# Altium schematic sheet Final_Project_Schematic.SchDoc
size A; SheetNumber: 1; SheetTotal: 1; SPICEModelCacheSEEFEDUI: <root> / <DocumentId>SEEFEDUI</DocumentId> / <CacheFrame Number="0"> / <Model Name="cap" Kind="MDL"> / <Text>*Default semiconductor capacitor / .MODEL CAP C()</Text> / </Model> / <Model Name="led2" Kind="MDL"> / <Text>*Typ RED,GREEN,YELLOW,AMBER GaAs LED: Vf=2.1V Vr=4V If=40mA trr=3uS / *LED Pinout: 1=A, 2=K / .MODEL LED2 D (IS=93.1P RS=42M N=4.61 BV=4 IBV=10U / + CJO=2.97P VJ=.75 M=.333 TT=4.32U)</Text> / </Model> / </CacheFrame> / </root>
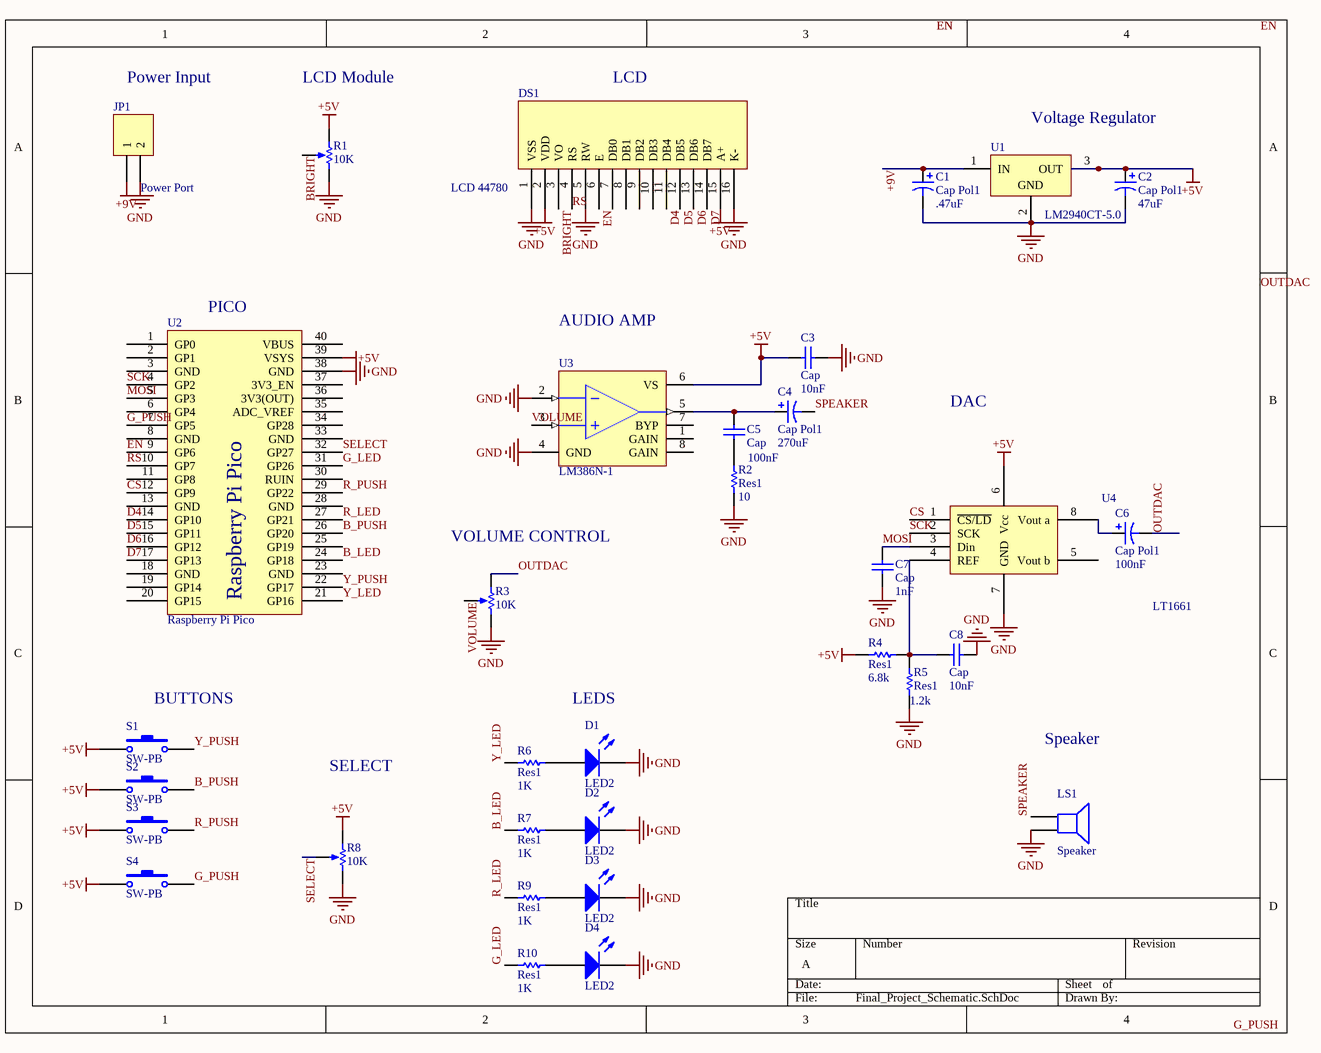
[diagram p0: Final_Project_Schematic.SchDoc]

## Parts
C1  Cap Pol1  value .47uF  [RB7.6-15]
C2  Cap Pol1  value 47uF  [RB7.6-15]
C3  Cap  value 10nF  [RAD-0.3]
C4  Cap Pol1  value 270uF  [RB7.6-15]
C5  Cap  value 100nF  [RAD-0.3]
C6  Cap Pol1  value 100nF  [RB7.6-15]
C7  Cap  value 1nF  [RAD-0.3]
C8  Cap  value 10nF  [RAD-0.3]
D1  LED2  [3.2X1.6X1.1]
D2  LED2  [3.2X1.6X1.1]
D3  LED2  [3.2X1.6X1.1]
D4  LED2  [3.2X1.6X1.1]
DS1  LCD 44780  [OLED 16x2]
JP1  Power Port  [CON2screw]
LS1  Speaker  [PIN2]
R1  value 10K  [POT OFFSET 200]  (hidden comment: RPot_3)
R2  Res1  value 10  [AXIAL-0.3]
R3  value 10K  [POT OFFSET 200]  (hidden comment: RPot_3)
R4  Res1  value 6.8k  [AXIAL-0.3]
R5  Res1  value 1.2k  [AXIAL-0.3]
R6  Res1  value 1K  [AXIAL-0.3]
R7  Res1  value 1K  [AXIAL-0.3]
R8  value 10K  [POT OFFSET 200]  (hidden comment: RPot_3)
R9  Res1  value 1K  [AXIAL-0.3]
R10  Res1  value 1K  [AXIAL-0.3]
S1  SW-PB  [SW PB vertical]
S2  SW-PB  [SW PB vertical]
S3  SW-PB  [SW PB vertical]
S4  SW-PB  [SW PB vertical]
U1  LM2940CT-5.0  [T03B]
U2  Raspberry Pi Pico  [Raspberry Pi Pico]
U3  LM386N-1  [DIP-8]
U4  LT1661  [DIP-8]

## Nets
+5V: C2.1 C3.1 DS1.2(VDD) DS1.15(A+) R1.1(TOP) R4.1 R8.1(TOP) S1.1 S2.1 S3.1 S4.1 U1.3(OUT) U2.39(VSYS) U3.6(VS) U4.6(Vcc)
+9V: C1.1 JP1.1 U1.1(IN)
GND: C1.2 C2.2 C3.2 C7.1 C8.2 D1.2(K) D2.2(K) D3.2(K) D4.2(K) DS1.1(VSS) DS1.5(RW) DS1.16(K-) JP1.2 LS1.2 R1.3(BOT) R2.1 R3.3(BOT) R5.1 R8.3(BOT) U1.2(GND) U2.38(GND) U3.2(IN-) U3.4(GND) U4.7(GND)
B_LED: R7.1 U2.24(GP18)
B_PUSH: S2.2 U2.26(GP20)
BRIGHT: DS1.3(VO) R1.2(TAP)
CS: U2.12(GP9) U4.1(~{CS/LD})
D4: DS1.11(DB4) U2.14(GP10)
D5: DS1.12(DB5) U2.15(GP11)
D6: DS1.13(DB6) U2.16(GP12)
D7: DS1.14(DB7) U2.17(GP13)
EN: DS1.6(E) U2.9(GP6)
G_LED: R10.1 U2.31(GP26)
G_PUSH: S4.2 U2.7(GP5)
MOSI: C7.2 U2.5(GP3) U4.3(Din)
OUTDAC: C6.2 R3.1(TOP)
R_LED: R9.1 U2.27(GP21)
R_PUSH: S3.2 U2.29(GP22)
RS: DS1.4(RS) U2.10(GP7)
SCK: U2.4(GP2) U4.2(SCK)
SELECT: R8.2(TAP) U2.32(GP27)
SPEAKER: C4.2 LS1.1
VOLUME: R3.2(TAP) U3.3(IN+)
Y_LED: R6.1 U2.21(GP16)
Y_PUSH: S1.2 U2.22(GP17)
NetC4_1: C4.1 C5.2 U3.5(OUT)
NetC5_1: C5.1 R2.2
NetC6_1: C6.1 U4.8(Vout_a)
NetC8_1: C8.1 R4.2 R5.2 U4.4(REF)
NetD1_1: D1.1(A) R6.2
NetD2_1: D2.1(A) R7.2
NetD3_1: D3.1(A) R9.2
NetD4_1: D4.1(A) R10.2

Not connected (* = marked no-connect by the designer): DS1 7(DB0) 8(DB1) 9(DB2) 10(DB3); U2 1(GP0) 2(GP1) 3(GND) 6(GP4) 8(GND) 11(GP8) 13(GND) 18(GND) 19(GP14) 20(GP15) 23(GND) 25(GP19) 28(GND) 30(RUIN) 33(GND) 34(GP28) 35(ADC_VREF) 36(3V3(OUT)) 37(3V3_EN) 40(VBUS); U3 1(GAIN) 7(BYP) 8(GAIN); U4 5(Vout_b)

## Notes on the sheet
- Power Input
- LCD Module
- LCD
- Voltage Regulator
- (near U2) PICO
- AUDIO AMP
- DAC
- (near R3) VOLUME CONTROL
- (near S1) BUTTONS
- LEDS
- SELECT
- Speaker
- Labels drawn without touching a wire or pin: EN, G_PUSH, OUTDAC

## Library data of the parts
C1 C2 C4 C6 = Cap Pol1: Polarized Capacitor (Radial); Published: 8-Jun-2000; LatestRevisionDate: 17-Jul-2002; LatestRevisionNote: Re-released for DXP Platform.; PackageReference: RB7.6-15; Publisher: Altium Limited; PackageDescription: Polarized Capacitor (Radial); 2 Leads
C3 C5 C7 C8 = Cap: Capacitor; Published: 8-Jun-2000; LatestRevisionDate: 17-Jul-2002; LatestRevisionNote: Re-released for DXP Platform.; PackageReference: RAD-0.3; Publisher: Altium Limited; PackageDescription: Radial Cap, Thru-Hole; 2 Leads; 0.3 in Pin Spacing
D1-D4 = LED2: Typical RED, GREEN, YELLOW, AMBER GaAs LED; Published: 8-Jun-2000; LatestRevisionDate: 17-Jul-2002; LatestRevisionNote: Re-released for DXP Platform.; PackageVersion: Feb-2002; PackageReference: 3.2X1.6X1.1; Publisher: Altium Limited; PackageDescription: SM LED; 2 Flat Leads
JP1 = Power
LS1 = Speaker: Loudspeaker; Published: 24-Mar-1999; LatestRevisionDate: 17-Jul-2002; LatestRevisionNote: Re-released for DXP Platform.; PackageReference: PIN2; Publisher: Altium Limited
R1 R3 R8 = RPot: Potentiometer; Sim Note: Enter the Resistance value and the set point into parameter fields.; Set Position: 0.5; Published: 8-Jun-2000; LatestRevisionDate: 17-Jul-2002; LatestRevisionNote: Re-released for DXP Platform.; Publisher: Altium Limited
R2 R4-R7 R9 R10 = Res1: Resistor; Published: 8-Jun-2000; LatestRevisionDate: 17-Jul-2002; LatestRevisionNote: Re-released for DXP Platform.; PackageReference: AXIAL-0.3; Publisher: Altium Limited; PackageDescription: Axial Device, Thru-Hole; 2 Leads; 0.3 in Pin Spacing
S1-S4 = SW-PB: DIGIKEY SW400-ND; Published: 24-Mar-1999; LatestRevisionDate: 17-Jul-2002; LatestRevisionNote: Re-released for DXP Platform.; Publisher: Altium Limited
U1 = LM2940CT-5.0_1: 1A Low Dropout Regulator, 3-pin TO-220; Manufacturer: National Semiconductor; PackageTopMarking: NSUZXYTTE#*LM2940CT*-5.0 P+; PowerWise: N; CompType: LDO IC; High-Reliability: Y; DatasheetVersion: Jan-2007; PackageVersion: revL, Jan-1992; PackageReference: T03B; PackageDescription: TO-220, Molded, 3 Lead, Straight; PartNumber: LM2940CT-5.0; RoHS: N; PinCount: 3; ComponentLink1Description: Manufacturer URL; ComponentLink1URL: http://www.national.com/; ComponentLink2Description: LM2940C Datasheet; ComponentLink2URL: http://www.national.com/ds/LM/LM2940C.pdf; ComponentLink3Description: LM2940C Web Page; ComponentLink3URL: http://www.national.com/pf/LM/LM2940C.html; ComponentLink4Description: T03B Package Page; ComponentLink4URL: http://www.national.com/packaging/folders/t03b.html
U3 = LM386N-1: Low-Voltage Audio Power Amplifier; Published: 15-Apr-2002; DatasheetDocument: Sep-1997; PackageDocument: Sep-1997; PackageReference: N08E; Publisher: Altium Limited